# Altium schematic sheet 120-12V-DCDC.SCHDOC: 120V - 12/15V DCDC Converter
size A4; Organization: UNSW Solar Racing Team; Address3: UNSW; Address4: Sydney NSW 2052; SheetNumber: 2; SheetTotal: 4; Address2: Electrical Engineering; Address1: Rm 109
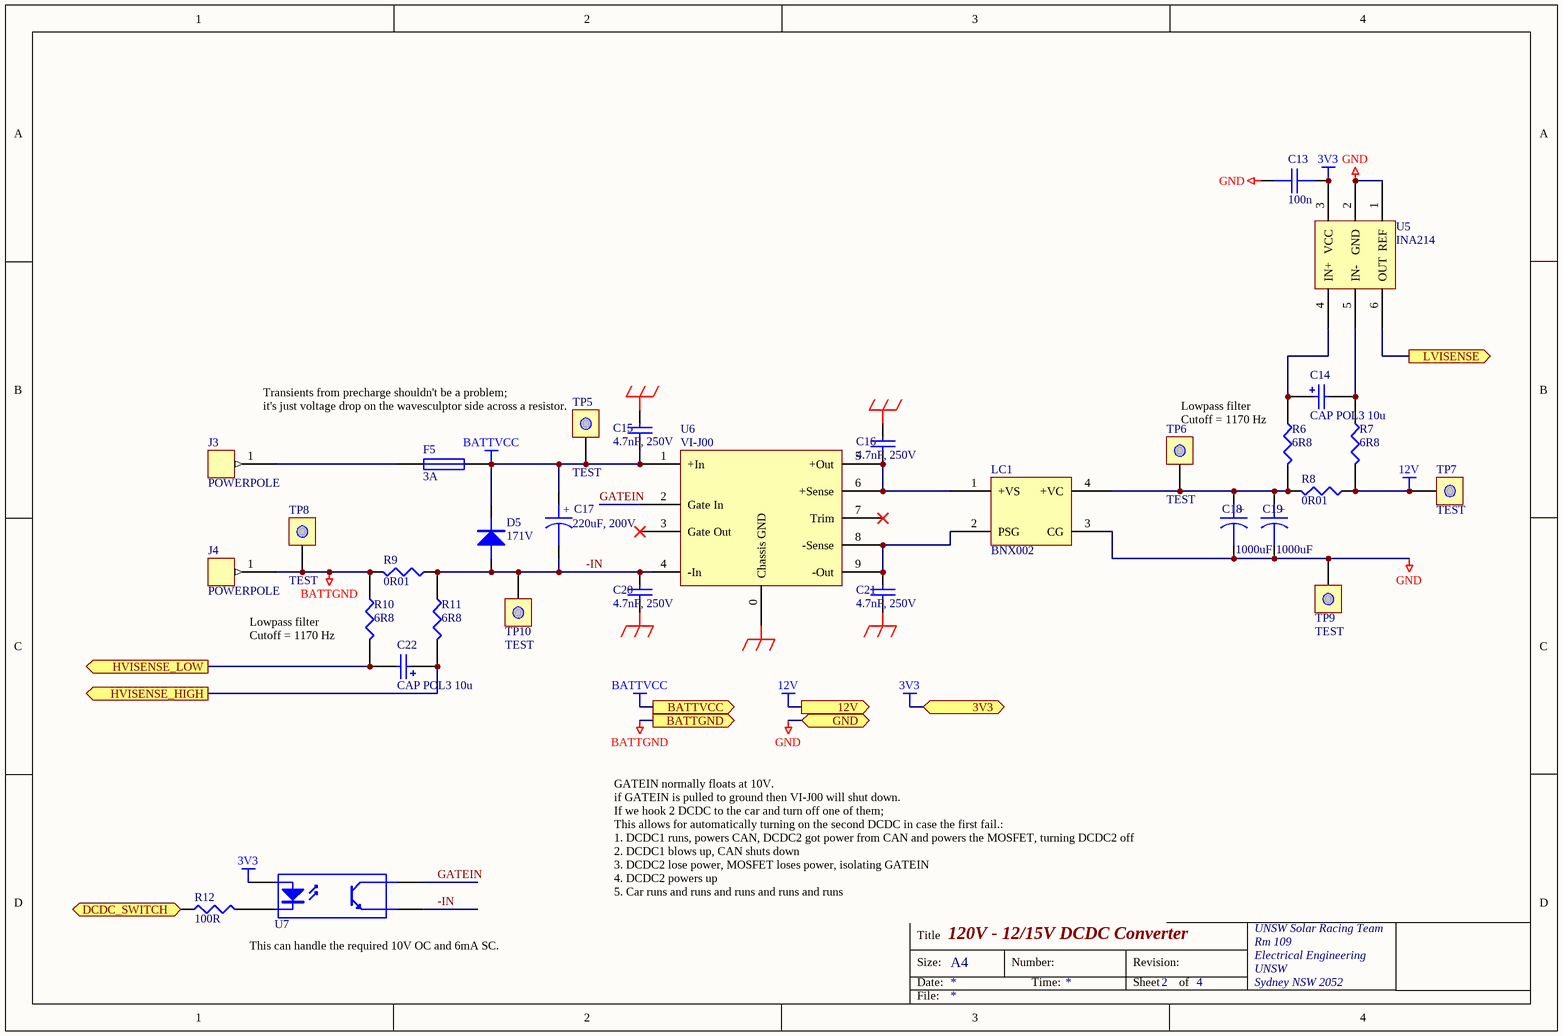
[diagram p0: 120-12V-DCDC.SCHDOC]

## Parts
C13  100n  [0603]
C14  CAP POL3 10u  [MCCT-CASEA]
C15  4.7nF, 250V  [POLYESTER-5]
C16  4.7nF, 250V  [POLYESTER-5]
C17  220uF, 200V  [ELECTROLYTIC-10-20]
C18  1000uF  [ELECTROLYTIC-5-10]
C19  1000uF  [ELECTROLYTIC-5-10]
C20  4.7nF, 250V  [POLYESTER-5]
C21  4.7nF, 250V  [POLYESTER-5]
C22  CAP POL3 10u  [MCCT-CASEA]
D5  171V  [DIODE-D1.2mm]
F5  3A  [FUSE-BAYONET-RA]
J3  POWERPOLE  [POWERPOLE25A]
J4  POWERPOLE  [POWERPOLE25A]
LC1  BNX002  [BNX002]
R6  6R8  [0603]
R7  6R8  [0603]
R8  0R01  [CRA2512]
R9  0R01  [CRA2512]
R10  6R8  [0603]
R11  6R8  [0603]
R12  100R  [0603]
TP5  TEST  [TESTPOINT]
TP6  TEST  [TESTPOINT]
TP7  TEST  [TESTPOINT]
TP8  TEST  [TESTPOINT]
TP9  TEST  [TESTPOINT]
TP10  TEST  [TESTPOINT]
U5  INA214  [SC70-6]
U6  VI-J00  [VI-J00]
U7  PC3H7J00000F  [PC3H7]  (value not drawn)

## Ports
3V3, 12V (out), BATTGND, BATTVCC (out), DCDC_SWITCH (in), GND (bidir), HVISENSE_HIGH (out), HVISENSE_LOW (out), LVISENSE (out)

## Nets
3V3: C13.2 U5.3(VCC) U7.1(A) ; port 3V3
12V: R7.2 R8.1 TP7.0(TP) ; port 12V
BATTGND: J4.1 R9.2 R10.1 TP8.0(TP) ; port BATTGND
BATTVCC: C15.1 C17.1 D5.K F5.1 TP5.0(TP) U6.1(+In) ; port BATTVCC
CGND: C15.2 C16.2 C20.1 C21.1 U6.0(Chassis_GND)
GND: C13.1 C18.2 C19.2 LC1.3(CG) TP9.0(TP) U5.1(REF) U5.2(GND) ; port GND
-IN: C17.2 C20.2 D5.A R9.1 R11.1 TP10.0(TP) U6.4(-In) U7.3(E)
DCDC_SWITCH: R12.1 ; port DCDC_SWITCH
GATEIN: U6.2(Gate_In) U7.4(C)
HVISENSE_HIGH: C22.1 R11.2 ; port HVISENSE_HIGH
HVISENSE_LOW: C22.2 R10.2 ; port HVISENSE_LOW
LVISENSE: U5.6(OUT) ; port LVISENSE
NetC14_1: C14.1 R6.1 U5.4(IN+)
NetC14_2: C14.2 R7.1 U5.5(IN-)
NetC16_1: C16.1 LC1.1(+VS) U6.5(+Out) U6.6(+Sense)
NetC18_1: C18.1 C19.1 LC1.4(+VC) R6.2 R8.2 TP6.0(TP)
NetC21_2: C21.2 LC1.2(PSG) U6.8(-Sense) U6.9(-Out)
NetF5_2: F5.2 J3.1
NetR12_2: R12.2 U7.2(K)

Not connected (* = marked no-connect by the designer): U6 3(Gate_Out)* 7(Trim)*

## Notes on the sheet
- (near TP5) Transients from precharge shouldn't be a problem;
  it's just voltage drop on the wavesculptor side across a resistor.
- Lowpass filter
  Cutoff = 1170 Hz
- (near R10) Lowpass filter
  Cutoff = 1170 Hz
- GATEIN normally floats at 10V.
  if GATEIN is pulled to ground then VI-J00 will shut down.
  If we hook 2 DCDC to the car and turn off one of them;
  This allows for automatically turning on the second DCDC in case the first fail.:
  1. DCDC1 runs, powers CAN, DCDC2 got power from CAN and powers the MOSFET, turning DCDC2 off
  2. DCDC1 blows up, CAN shuts down
  3. DCDC2 lose power, MOSFET loses power, isolating GATEIN
  4. DCDC2 powers up
  5. Car runs and runs and runs and runs and runs
- This can handle the required 10V OC and 6mA SC.
- Title
- Size:
- Date:
- A4
- Number:
- Time:
- Revision:
- Sheet
- of
- File:
- (in symbol CAPACITOR POL) +

## Library data of the parts
C13 C15 C16 C20 C21 = CAP: Capacitor
  C13: Price: 0.30
  C15 C16 C20 C21: Price: 0.18; Farnell: 1166076; Digikey: 3005PH-ND; DigikeyPrice: 0.124
C14 C22 = CAP POL3: Polarized Capacitor (Surface Mount); Revision: July-2002: Re-released for DXP Platform.; Digikey: 478-3121-1-ND; DigikeyPrice: 0.41; Farnell: 1432264; FarnellPrice: 0.30
C17-C19 = CAPACITOR POL: Capacitor
  C17: FarnellPrice: 2.91; Farnell: 1040995; Digikey: 493-2504-ND; DigikeyPrice: 2.05
  C18 C19: Price: 1.36; Farnell: 9451226
D5 = DIODE: Order#: 1017610; Supplier: Farnell; Price: ?
F5 = FUSE1: Fuse; Price: 5.43; Farnell: 149-920; Digikey: -
J3 = CON1: RS: 534-985 + 534-963; Farnell: -; Digikey: -
J4 = CON1: RS: 534-979 + 534-963; Farnell: -; Digikey: -
LC1 = BNX002: 10A Switchmode Supply Output Filter; Farnell: 9526943; FarnellPrice: 15.0; Digikey: BNX002-01; DigikeyPrice: 11.90
R6 R7 R10 R11 = RES1
R8 R9 = CRA2512: Current Sense Resistor; Farnell: 1435947; Price: 0.736
  R9: Digikey: CRA2512-FZ-R010ELFCT-ND; DigikeyPrice: 0.49
R12 = RES1: Resistor
TP5-TP10 = TEST: TEST POINT
U5 = INA214: Current Sensor; Farnell: 1606447; Digikey: 296-23422-1-ND
U6 = VI-J00: VI-J00 Switch Mode DC-DC Converter
U7 = PC3H7J00000F: Opto-coupler; Farnell: 9707603; FarnellPrice: 0.6; Digikey: 425-2116-1-ND; DigikeyPrice: 0.45